# Altium project ZenDriver_Master.PrjPcb
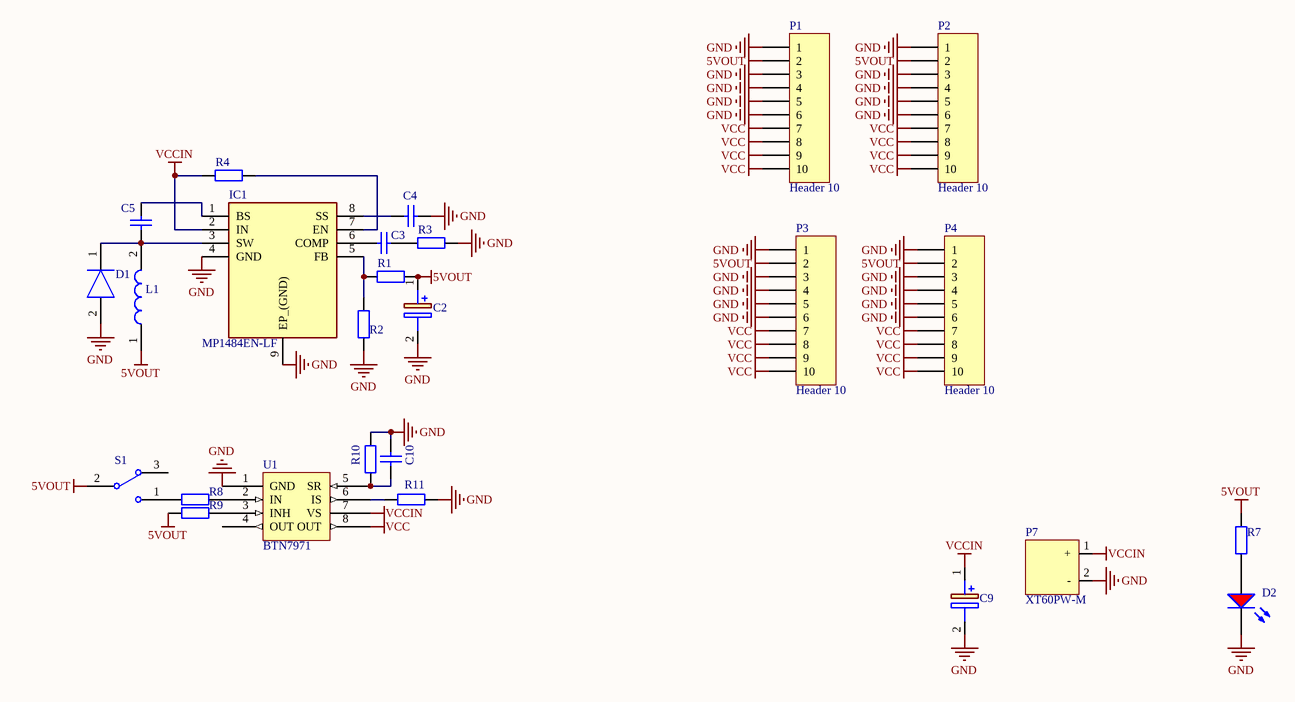
[diagram p0: ZenDriver_Master.SchDoc]
1 sheet, 26 parts. Net scope: global (net labels, ports and power ports of the same name join across sheets).
Board file: ZenDriver_Master.PcbDoc

## Sheet ZenDriver_Master.SchDoc
size A4

### Parts
C2  10uF 4.5V tan  [CAPPM7343X310N]  (value not drawn)
C3  6.8nF (682) 10% 50V  [0603_C]  (value not drawn)
C4  100nF (104) 10% 50V  [0603_C]  (value not drawn)
C5  10nF (103) 10% 50V  [0603_C]  (value not drawn)
C9  1000uf 25v  [CAPAE1350X1400N]  (value not drawn)
C10  100nF (104) 10% 50V  [0603_C]  (value not drawn)
D1  B130LAW-7-F  [SOD3716X145N]  (value not drawn)
D2  红灯 0603  [0603_LED_S1]  (value not drawn)
IC1  MP1484EN-LF  [SOIC127P600X170-9N]
L1  1040 10UH 5A  [74404064470]  (value not drawn)
P1  Header 10  [HDR1X10]
P2  Header 10  [HDR1X10]
P3  Header 10  [HDR1X10]
P4  Header 10  [HDR1X10]
P7  XT60PW-M  [XT60PW-M]
R1  44.2K  [0603_R]  (value not drawn)
R2  10KΩ (1002) ±1%  [0603_R]  (value not drawn)
R3  6.8KΩ (6801) ±1%  [0603_R]  (value not drawn)
R4  100KΩ (1003) ±1%  [0603_R]  (value not drawn)
R7  4.7k  [0603_R]  (value not drawn)
R8  10KΩ (1002) ±1%  [0603_R]  (value not drawn)
R9  10KΩ (1002) ±1%  [0603_R]  (value not drawn)
R10  1KΩ (1001) ±1%  [0603_R]  (value not drawn)
R11  2KΩ (2001) ±1%  [0603_R]  (value not drawn)
S1  SW-SPDT  [sw_9*3.5*5.5mm]  (value not drawn)
U1  BTN7971  [DPAK127P1615X127-8N]

### Nets
5VOUT: C2.1(+) L1.1 P1.2 P2.2 P3.2 P4.2 R1.2 R7.2 R9.1 S1.2
GND: C2.2(-) C4.2 C9.2(+) C10.2 D1.2(A) D2.K IC1.4(GND) IC1.9(EP_(GND)) P1.1 P1.3 P1.4 P1.5 P1.6 P2.1 P2.3 P2.4 P2.5 P2.6 P3.1 P3.3 P3.4 P3.5 P3.6 P4.1 P4.3 P4.4 P4.5 P4.6 P7.2(-) R2.1 R3.2 R10.2 R11.1 U1.1(GND)
VCC: P1.7 P1.8 P1.9 P1.10 P2.7 P2.8 P2.9 P2.10 P3.7 P3.8 P3.9 P3.10 P4.7 P4.8 P4.9 P4.10 U1.8(OUT)
VCCIN: C9.1(-) IC1.2(IN) P7.1(+) R4.1 U1.7(VS)
NetC3_1: C3.1 IC1.6(COMP)
NetC3_2: C3.2 R3.1
NetC4_1: C4.1 IC1.8(SS)
NetC5_1: C5.1 D1.1(K) IC1.3(SW) L1.2
NetC5_2: C5.2 IC1.1(BS)
NetC10_1: C10.1 R10.1 U1.5(SR)
NetD2_A: D2.A R7.1
NetIC1_5: IC1.5(FB) R1.1 R2.2
NetIC1_7: IC1.7(EN) R4.2
NetR8_1: R8.1 S1.1
NetR8_2: R8.2 U1.2(IN)
NetR9_2: R9.2 U1.3(INH)
NetR11_2: R11.2 U1.6(IS)

Not connected (* = marked no-connect by the designer): S1 3; U1 4(OUT)

### Library data of the parts
C2 = T494D106K035AH: Manufacturer_Name: Kemet; Datasheet Link: http://www.mouser.com/ds/2/212/kemet_kem_t2008_t494-544880.pdf; Height: 3.1mm; Manufacturer_Part_Number: T494D106K035AH; Mouser Part Number: 80-T494D106K035AH; Mouser Price/Stock: https://www.mouser.com/Search/Refine.aspx?Keyword=80-T494D106K035AH
C3 = 0603 6.8nF (682) 10% 50V: 贴片电容; ComponentLink1Description: 供应商链接; ComponentLink1URL: http://www.szlcsc.com/product/details_1983.html; Package: 0603; Supplier: LC; SuppliersPartNumber: C1631
C4 C10 = 0603 100nF (104) 10% 50V: 贴片电容; ComponentLink1Description: 供应商链接; ComponentLink1URL: http://www.szlcsc.com/product/details_15331.html; Package: 0603; Supplier: LC; SuppliersPartNumber: C14663
C5 = 0603 10nF (103) 10% 50V: 贴片电容; ComponentLink1Description: 供应商链接; ComponentLink1URL: http://www.szlcsc.com/product/details_58143.html; Package: 0603; Supplier: LC; SuppliersPartNumber: C57112
C9 = 865060462010: Capacitor Polarised; Manufacturer_Name: Wurth Elektronik; Datasheet Link: https://katalog.we-online.de/pbs/datasheet/865060462010.pdf; Height: 14mm; Manufacturer_Part_Number: 865060462010; Mouser Part Number: 710-865060462010; Mouser Price/Stock: https://www.mouser.com/Search/Refine.aspx?Keyword=710-865060462010; RS Part Number: 8395599; RS Price/Stock: https://uk.rs-online.com/web/p/products/8395599
D1 = B130LAW-7-F: Diode; Manufacturer_Name: Diodes Inc.; Allied_Number: 70437536; Datasheet Link: http://docs-emea.rs-online.com/webdocs/104e/0900766b8104e347.pdf; Height: 1.45mm; Manufacturer_Part_Number: B130LAW-7-F; Mouser Part Number: 621-B130LAW-F; Mouser Price/Stock: https://www.mouser.com/Search/Refine.aspx?Keyword=621-B130LAW-F; RS Part Number: 7513193P; RS Price/Stock: http://uk.rs-online.com/web/p/products/7513193P; Allied Price/Stock: http://www.alliedelec.com/diodes-inc-b130law-7-f/70437536/
D2 = 0603 红灯: 发光二极管; ComponentLink1Description: 供应商链接; ComponentLink1URL: http://www.szlcsc.com/product/details_2659.html; Package: 0603; Supplier: LC; SuppliersPartNumber: C2286
IC1 = MP1484EN-LF: Integrated Circuit; Manufacturer_Name: Monolithic Power Systems (MPS); Datasheet Link: http://www.mouser.com/datasheet/2/277/MP1484-1186021.pdf; Height: 1.7mm; Manufacturer_Part_Number: MP1484EN-LF; Mouser Part Number: 946-MP1484ENLF; Mouser Price/Stock: https://www.mouser.com/Search/Refine.aspx?Keyword=946-MP1484ENLF
L1 = 74404064100: Inductor; Manufacturer_Name: Wurth Elektronik; Datasheet Link: https://katalog.we-online.com/pbs/datasheet/74404064100.pdf; Height: 4mm; Manufacturer_Part_Number: 74404064100; Mouser Part Number: 710-74404064100; Mouser Price/Stock: https://www.mouser.com/Search/Refine.aspx?Keyword=710-74404064100; RS Part Number: 8142663P; RS Price/Stock: http://uk.rs-online.com/web/p/products/8142663P
P1-P4 = Header 10: Header, 10-Pin; LatestRevisionDate: 17-Jul-2002; LatestRevisionNote: Re-released for DXP Platform.; Publisher: Altium Limited
P7 = XT60
R1 = 0603 1.5KΩ (1501) 1%: 贴片电阻; ComponentLink1Description: 供应商链接; ComponentLink1URL: http://www.szlcsc.com/product/details_23570.html; Package: 0603; Supplier: LC; SuppliersPartNumber: C22843
R2 R8 R9 = 0603 10KΩ (1002) 1%: 贴片电阻; ComponentLink1Description: 供应商链接; ComponentLink1URL: http://www.szlcsc.com/product/details_26547.html; Package: 0603; Supplier: LC; SuppliersPartNumber: C25804
R3 = 0603 6.8KΩ (6801) 1%: 贴片电阻; ComponentLink1Description: 供应商链接; ComponentLink1URL: http://www.szlcsc.com/product/details_23939.html; Package: 0603; Supplier: LC; SuppliersPartNumber: C23212
R4 = 0603 100KΩ (1003) 1%: 贴片电阻; ComponentLink1Description: 供应商链接; ComponentLink1URL: http://www.szlcsc.com/product/details_26546.html; Package: 0603; Supplier: LC; SuppliersPartNumber: C25803
R7 = 0603 470Ω (4700) 1%: 贴片电阻; ComponentLink1Description: 供应商链接; ComponentLink1URL: http://www.szlcsc.com/product/details_23906.html; Package: 0603; Supplier: LC; SuppliersPartNumber: C23179
R10 = 0603 1KΩ (1001) 1%: 贴片电阻; ComponentLink1Description: 供应商链接; ComponentLink1URL: http://www.szlcsc.com/product/details_21904.html; Package: 0603; Supplier: LC; SuppliersPartNumber: C21190
R11 = 0603 2KΩ (2001) 1%: 贴片电阻; ComponentLink1Description: 供应商链接; ComponentLink1URL: http://www.szlcsc.com/product/details_23702.html; Package: 0603; Supplier: LC; SuppliersPartNumber: C22975
S1 = SW-SPDT: SPDT Subminiature Toggle Switch, Right Angle Mounting, Vertical Actuation; Published: 24-Mar-1999; LatestRevisionDate: 17-Dec-2003; LatestRevisionNote: Schematic revised, PCB Footprint replaced.; DatasheetVersion: 05-Dec-2000; PackageReference: TL36WW15050; Publisher: Altium Limited; PackageDescription: Switch; 4 Leads; ComponentLink1Description: Manufacturer Link; ComponentLink1URL: http://www.apem.com